# Altium project HÜMA_USV.PrjPcb
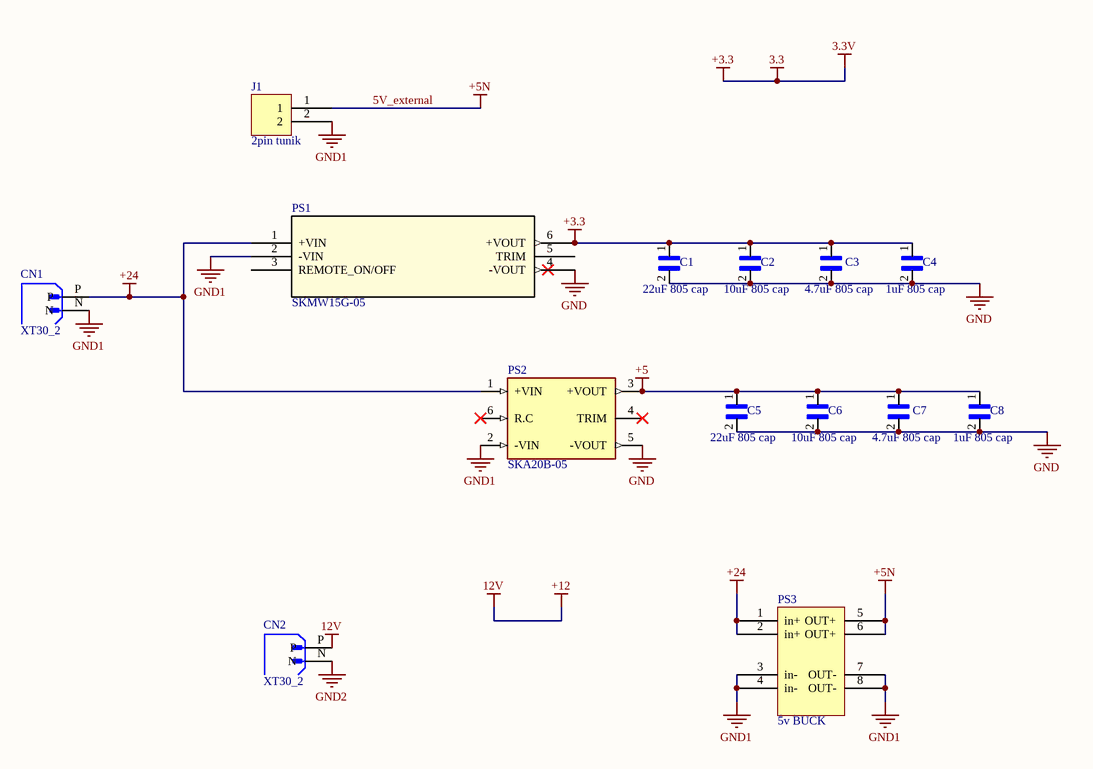
[diagram p0: Power.SchDoc]
10 sheets, 153 parts. Net scope: global (net labels, ports and power ports of the same name join across sheets).
Board file: HÜMA_USV.PcbDoc
Sheets:
  Hüma_USV_Main.SchDoc
  Power.SchDoc
  Battey_Voltage.SchDoc
  Flash_Driver.SchDoc
  BNO055.SchDoc
  NEO-M9N.SchDoc
  ekstralar.SchDoc
  Teensy4.1.SchDoc
  Emergancy.SchDoc
  Motor_ESC.SchDoc

## Sheet Hüma_USV_Main.SchDoc
size A4; SheetNumber: 1; SheetTotal: 1

## Sheet Power.SchDoc
size A4; SheetNumber: 2; SheetTotal: 10

### Parts
C1  22uF 805 cap  [1uF 805 Cap]
C2  10uF 805 cap  [1uF 805 Cap]
C3  4.7uF 805 cap  [1uF 805 Cap]
C4  1uF 805 cap  [1uF 805 Cap]
C5  22uF 805 cap  [1uF 805 Cap]
C6  10uF 805 cap  [1uF 805 Cap]
C7  4.7uF 805 cap  [1uF 805 Cap]
C8  1uF 805 cap  [1uF 805 Cap]
CN1  XT30_2  [XT30_2]
CN2  XT30_2  [XT30_2]
J1  2pin tunik  [2pin tunşk]
PS1  SKMW15G-05  [SKMW15DKMW15_MWU]
PS2  SKA20B-05  [CONV_SKA20B-05]
PS3  5v BUCK  [5V Buck Conv]

### Nets
5V_external: J1.1 PS3.5(OUT+) PS3.6(OUT+)  [also labelled +5N]
+3.3: C1.1 C2.1 C3.1 C4.1 PS1.6(+VOUT)  [also labelled 3.3, 3.3V]  [project net XTAL_IN]
+5: C5.1 C6.1 C7.1 C8.1 PS2.3(+VOUT)
+12: CN2.P  [also labelled 12V]
+24: CN1.P PS1.1(+VIN) PS2.1(+VIN) PS3.1(in+) PS3.2(in+)
GND: C1.2 C2.2 C3.2 C4.2 C5.2 C6.2 C7.2 C8.2 PS1.4(-VOUT) PS2.5(-VOUT)
GND1: CN1.N J1.2 PS1.2(-VIN) PS2.2(-VIN) PS3.3(in-) PS3.4(in-) PS3.7(OUT-) PS3.8(OUT-)
GND2: CN2.N

Not connected (* = marked no-connect by the designer): PS1 3(REMOTE_ON/OFF) 5(TRIM); PS2 4(TRIM)* 6(R.C)*

### Library data of the parts
C1-C3 C5-C7 = 1uF 805 cap
PS1 = SKMW15G-03_1: No Description Available; Manufacturer_Name: Mean Well; Copyright: Copyright (C) 2025 Ultra Librarian. All rights reserved.; Manufacturer_Part_Number: SKMW15G-05; RefDes: RefDes; Type: Type
PS2 = SKA20B-05: Isolated Module DC DC Converter 1 Output 5V 4A 18V - 36V Input; Package: None; Price: None; Value: *; MP: SKA20B-05; Availability: Unavailable

## Sheet Battey_Voltage.SchDoc
size A4; SheetNumber: 3; SheetTotal: 9
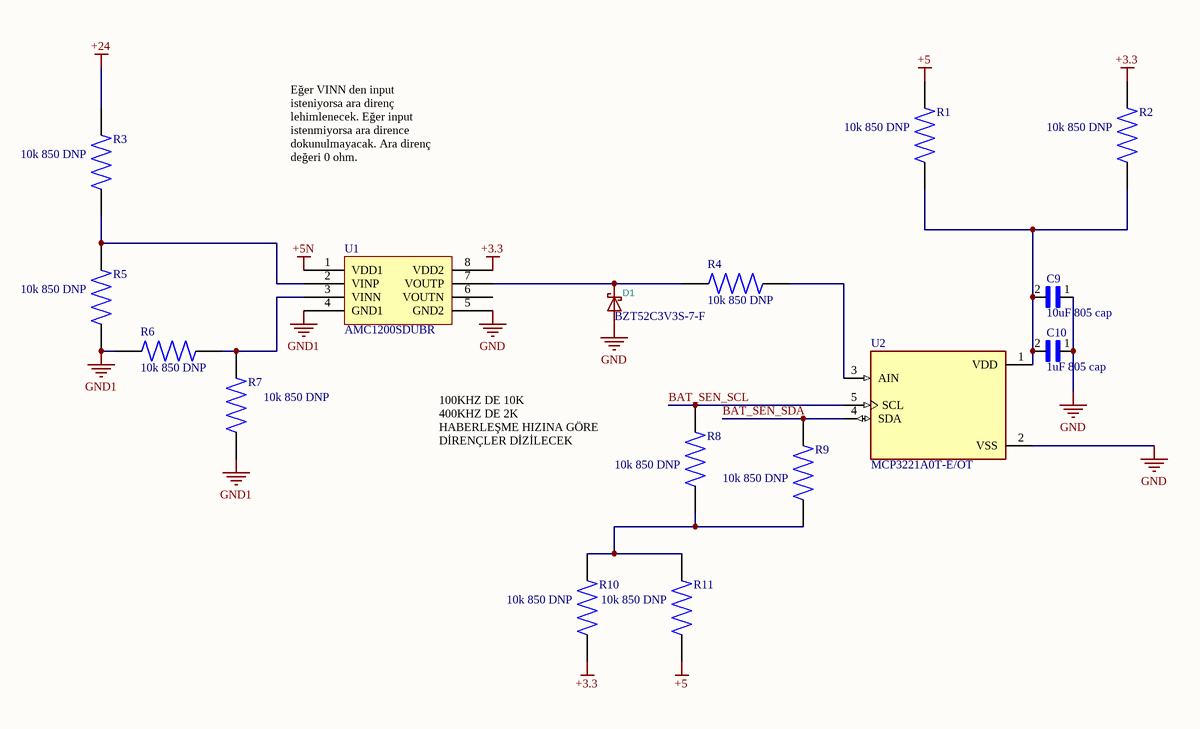
[diagram p1: Battey_Voltage.SchDoc]

### Parts
C9  10uF 805 cap  [1uF 805 Cap]
C10  1uF 805 cap  [1uF 805 Cap]
D1  BZT52C3V3S-7-F  [SOD2513X120N]
R1  10k 850 DNP  [10k 850]
R2  10k 850 DNP  [10k 850]
R3  10k 850 DNP  [10k 850]
R4  10k 850 DNP  [10k 850]
R5  10k 850 DNP  [10k 850]
R6  10k 850 DNP  [10k 850]
R7  10k 850 DNP  [10k 850]
R8  10k 850 DNP  [10k 850]
R9  10k 850 DNP  [10k 850]
R10  10k 850 DNP  [10k 850]
R11  10k 850 DNP  [10k 850]
U1  AMC1200SDUBR  [SOP254P1040X485-8N]
U2  MCP3221A0T-E/OT  [SOT95P280X145-5N]

### Nets
+3.3: R2.1 R10.2 U1.8(VDD2)  [project net XTAL_IN]
+5: R1.1 R11.2
+5N: U1.1(VDD1)  [project net 5V_external]
+24: R3.1
GND: C9.1 C10.1 D1.A U1.5(GND2) U2.2(VSS)
GND1: R5.2 R6.2 R7.1 U1.4(GND1)
BAT_SEN_SCL: R8.2 U2.5(SCL)
BAT_SEN_SDA: R9.2 U2.4(SDA)
NetC9_2: C9.2 C10.2 R1.2 R2.2 U2.1(VDD)
NetD1_K: D1.K R4.1 U1.7(VOUTP)
NetR3_2: R3.2 R5.1 U1.2(VINP)
NetR4_2: R4.2 U2.3(AIN)
NetR6_1: R6.1 R7.2 U1.3(VINN)
NetR8_1: R8.1 R9.1 R10.1 R11.1

Not connected (* = marked no-connect by the designer): U1 6(VOUTN)

### Notes on the sheet
- Eğer VINN den input isteniyorsa ara direnç lehimlenecek. Eğer input istenmiyorsa ara dirence dokunulmayacak. Ara direnç değeri 0 ohm.
- 100KHZ DE 10K
  400KHZ DE 2K
  HABERLEŞME HIZINA GÖRE DİRENÇLER DİZİLECEK

### Library data of the parts
C9 = 1uF 805 cap
D1 = BZT52C3V3S-7-F: ki_keywords: Schottky; ki_description: Schottky Diode; Datasheet: https://diotec.com/de/produktliste/SBD.html
R1-R11 = 10k 850
U2 = MCP3221A0T-E/OT: 12-bit ADC, I2C, single channel5 SOT-23 T/R | Microchip Technology Inc. MCP3221A0T-E/OT; SnapEDA_Link: https://www.snapeda.com/parts/MCP3221A0T-E/OT/Microchip/view-part/?ref=snap; Package: SOT-23 Microchip; Value: *; MF: Microchip Technology; MP: MCP3221A0T-E/OT; Check_prices: https://www.snapeda.com/parts/MCP3221A0T-E/OT/Microchip/view-part/?ref=eda

## Sheet Flash_Driver.SchDoc
size A4; SheetNumber: 4; SheetTotal: 9
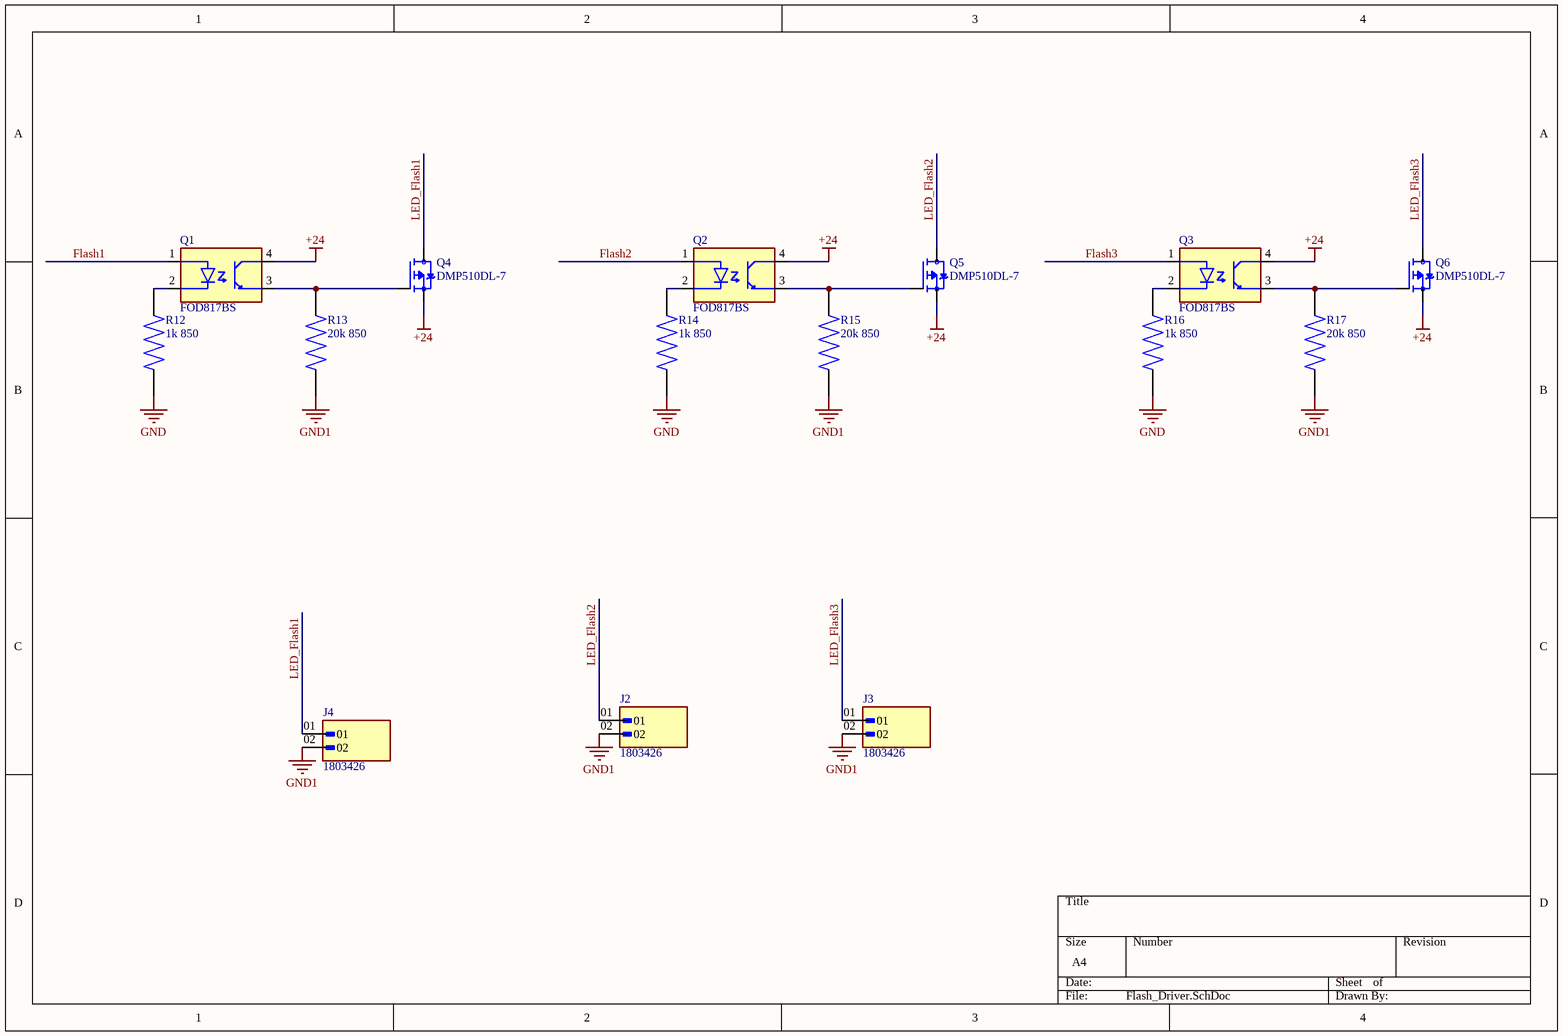
[diagram p2: Flash_Driver.SchDoc]

### Parts
J2  1803426  [PHOENIX_1803426]
J3  1803426  [PHOENIX_1803426]
J4  1803426  [PHOENIX_1803426]
Q1  FOD817BS  [SOIC254P1016X385-4N]
Q2  FOD817BS  [SOIC254P1016X385-4N]
Q3  FOD817BS  [SOIC254P1016X385-4N]
Q4  DMP510DL-7  [SOT91P240X110-3N - duplicate]
Q5  DMP510DL-7  [SOT91P240X110-3N - duplicate]
Q6  DMP510DL-7  [SOT91P240X110-3N - duplicate]
R12  1k 850  [10k 850]
R13  20k 850  [10k 850]
R14  1k 850  [10k 850]
R15  20k 850  [10k 850]
R16  1k 850  [10k 850]
R17  20k 850  [10k 850]

### Nets
+24: Q1.4(COLLECTOR) Q2.4(COLLECTOR) Q3.4(COLLECTOR) Q4.2(S) Q5.2(S) Q6.2(S)
GND: R12.2 R14.2 R16.2
GND1: J2.02 J3.02 J4.02 R13.2 R15.2 R17.2
Flash1: Q1.1(ANODE)
Flash2: Q2.1(ANODE)
Flash3: Q3.1(ANODE)
LED_Flash1: J4.01 Q4.3(D)
LED_Flash2: J2.01 Q5.3(D)
LED_Flash3: J3.01 Q6.3(D)
NetQ1_2: Q1.2(CATHODE) R12.1
NetQ1_3: Q1.3(EMITTER) Q4.1(G) R13.1
NetQ2_2: Q2.2(CATHODE) R14.1
NetQ2_3: Q2.3(EMITTER) Q5.1(G) R15.1
NetQ3_2: Q3.2(CATHODE) R16.1
NetQ3_3: Q3.3(EMITTER) Q6.1(G) R17.1

### Library data of the parts
J2-J4 = 1803426: Pluggable Header 3.81mm 16AWG 160V 8A 2 Position COMBICON MCV Series | Phoenix Contact 1803426; SnapEDA_Link: https://www.snapeda.com/parts/1803426/Phoenix+Contact/view-part/?ref=snap; Package: None; Value: *; MF: Phoenix Contact; MP: 1803426; Check_prices: https://www.snapeda.com/parts/1803426/Phoenix+Contact/view-part/?ref=eda
Q1-Q3 = FOD817BS: Transistor Output Optocouplers Opto Phototransistor Output SM-DIP4; MF: ON Semiconductor; SnapEDA_Link: https://www.snapeda.com/parts/FOD817BS/Onsemi/view-part/?ref=snap; Package: SMD-4 ON Semiconductor; Value: *; MP: FOD817BS; Check_prices: https://www.snapeda.com/parts/FOD817BS/Onsemi/view-part/?ref=eda
R12-R17 = 10k 850

## Sheet BNO055.SchDoc
size A4; SheetNumber: 5; SheetTotal: 10
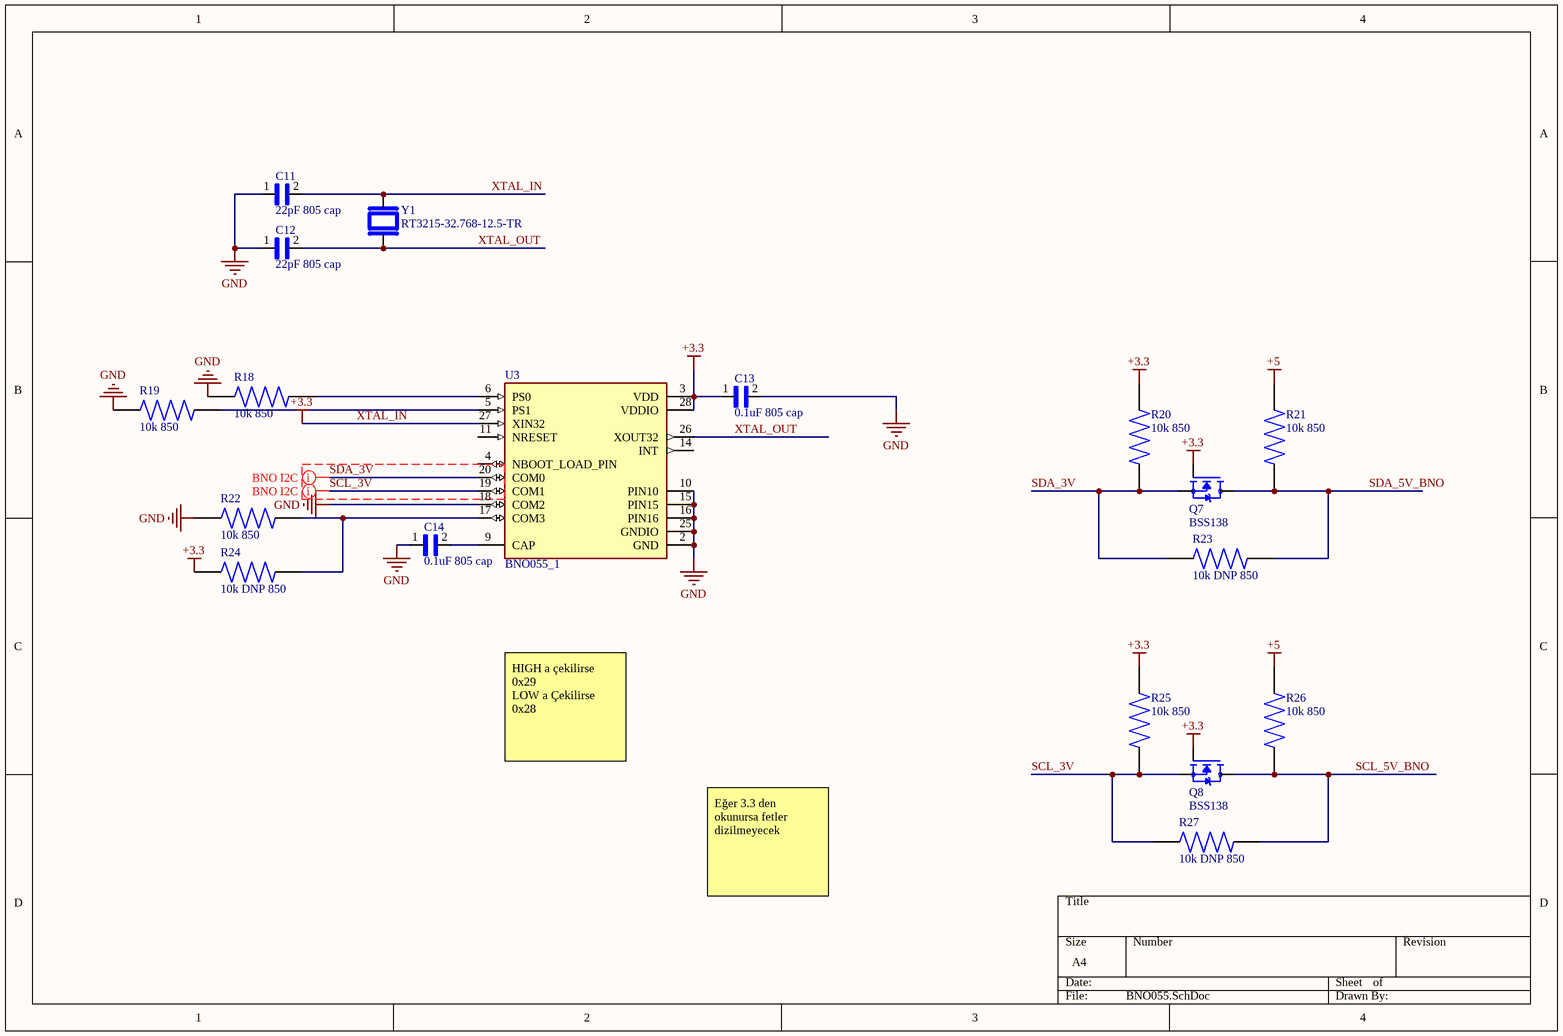
[diagram p3: BNO055.SchDoc]

### Parts
C11  22pF 805 cap  [1uF 805 Cap]
C12  22pF 805 cap  [1uF 805 Cap]
C13  0.1uF 805 cap  [1uF 805 Cap]
C14  0.1uF 805 cap  [1uF 805 Cap]
Q7  BSS138  [SOT91P240X110-3N - duplicate]
Q8  BSS138  [SOT91P240X110-3N - duplicate]
R18  10k 850  [10k 850]
R19  10k 850  [10k 850]
R20  10k 850  [10k 850]
R21  10k 850  [10k 850]
R22  10k 850  [10k 850]
R23  10k DNP 850  [10k 850]
R24  10k DNP 850  [10k 850]
R25  10k 850  [10k 850]
R26  10k 850  [10k 850]
R27  10k DNP 850  [10k 850]
U3  BNO055_1  [LGA28R50P4X10_380X520X100]
Y1  RT3215-32.768-12.5-TR  [XTAL_RT3215-32.768-12.5-TR]

### Nets
+5: R21.1 R26.1
GND: C11.1 C12.1 C13.2 C14.1 R18.1 R19.1 R22.1 U3.2(GND) U3.10(PIN10) U3.15(PIN15) U3.16(PIN16) U3.18(COM2) U3.25(GNDIO)
XTAL_IN: C11.2 C13.1 Q7.1(G) Q8.1(G) R20.1 R24.1 R25.1 U3.3(VDD) U3.27(XIN32) U3.28(VDDIO) Y1.1  [also labelled +3.3]
SCL_3V: Q8.2(S) R25.2 R27.1 U3.19(COM1)
SCL_5V_BNO: Q8.3(D) R26.2 R27.2  [project net BNO055SDA]
SDA_3V: Q7.2(S) R20.2 R23.1 U3.20(COM0)
SDA_5V_BNO: Q7.3(D) R21.2 R23.2  [project net BNO055SCL]
XTAL_OUT: C12.2 U3.26(XOUT32) Y1.2
NetC14_2: C14.2 U3.9(CAP)
NetR18_2: R18.2 U3.6(PS0)
NetR19_2: R19.2 U3.5(PS1)
NetR22_2: R22.2 R24.2 U3.17(COM3)

Not connected (* = marked no-connect by the designer): U3 4(NBOOT_LOAD_PIN) 11(NRESET) 14(INT)

### Layout directives
mark named BNO I2C: SCL_3V, SDA_3V

### Notes on the sheet
- HIGH a çekilirse 0x29
  LOW a Çekilirse 0x28
- Eğer 3.3 den okunursa fetler dizilmeyecek

### Library data of the parts
C11-C14 = 1uF 805 cap
Q7 Q8 = BSS138: N-Channel 50 V 220mA (Ta) 350mW (Ta) Surface Mount SOT-23-3; MF: onsemi; SnapEDA_Link: https://www.snapeda.com/parts/BSS138/Onsemi/view-part/?ref=snap; Package: SOT-23-3 ON Semiconductor; Value: *; MP: BSS138; Check_prices: https://www.snapeda.com/parts/BSS138/Onsemi/view-part/?ref=eda
R23 R24 R27 = 10k 850
U3 = BNO055_1: BNO055 9-axis Absolute Orientation Sensor ( SiP ) w/Sensors and Sensor Fusion; Package: None; Price: None; Value: *; MP: BNO055; Availability: Unavailable
Y1 = RT3215-32.768-12.5-TR: 32.768 kHz Â±20ppm Crystal 12.5pF 70 kOhms 2-SMD, No Lead; MF: Raltron Electronics; Package: SMD-2 Raltron Electronics; Price: None; Check_prices: https://www.snapeda.com/parts/RT3215-32.768-12.5-TR/Raltron+Electronics/view-part/?ref=eda; Value: *; SnapEDA_Link: https://www.snapeda.com/parts/RT3215-32.768-12.5-TR/Raltron+Electronics/view-part/?ref=snap; MP: RT3215-32.768-12.5-TR; Availability: In Stock; Purchase-URL: https://pricing.snapeda.com/search?q=RT3215-32.768-12.5-TR&ref=eda

## Sheet NEO-M9N.SchDoc
size A4; SheetNumber: 6; SheetTotal: 10
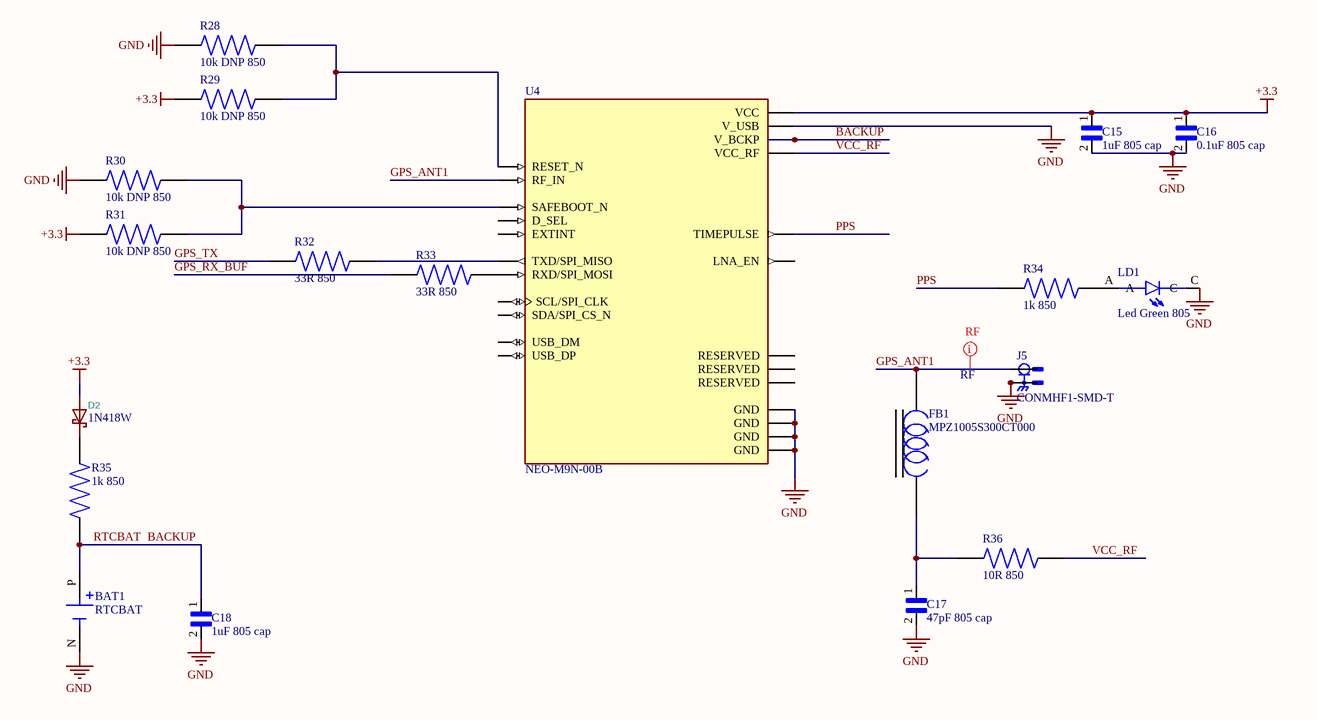
[diagram p4: NEO-M9N.SchDoc]

### Parts
BAT1  RTCBAT  [RTCBATTERY]
C15  1uF 805 cap  [1uF 805 Cap]
C16  0.1uF 805 cap  [1uF 805 Cap]
C17  47pF 805 cap  [1uF 805 Cap]
C18  1uF 805 cap  [1uF 805 Cap]
D2  1N418W  [SOD-523]
FB1  MPZ1005S300CT000  [BEADC1005X50N]
J5  CONMHF1-SMD-T  [TE_CONMHF1-SMD-T]
LD1  Led Green 805  [Led Green 805]
R28  10k DNP 850  [10k 850]
R29  10k DNP 850  [10k 850]
R30  10k DNP 850  [10k 850]
R31  10k DNP 850  [10k 850]
R32  33R 850  [10k 850]
R33  33R 850  [10k 850]
R34  1k 850  [10k 850]
R35  1k 850  [10k 850]
R36  10R 850  [10k 850]
U4  NEO-M9N-00B  [XCVR_NEO-M9N-00B]

### Nets
+3.3: C15.1 C16.1 D2.A R29.1 R31.1 U4.23(VCC)  [project net XTAL_IN]
GND: BAT1.N(NEG) C15.2 C16.2 C17.2 C18.2 J5.2(GND) J5.3(GND) J5.4(GND) LD1.C R28.1 R30.1 U4.7(V_USB) U4.10(GND) U4.12(GND) U4.13(GND) U4.24(GND)
BACKUP: BAT1.P(POS) C18.1 R35.2 U4.22(V_BCKP)  [also labelled RTCBAT]
GPS_ANT1: FB1.1 J5.1(SIG) U4.11(RF_IN)
GPS_RX_BUF: R33.1
GPS_TX: R32.1
PPS: R34.1 U4.3(TIMEPULSE)
VCC_RF: R36.2 U4.9(VCC_RF)
NetC17_1: C17.1 FB1.2 R36.1
NetD2_K: D2.K R35.1
NetLD1_A: LD1.A R34.2
NetR28_2: R28.2 R29.2 U4.8(RESET_N)
NetR30_2: R30.2 R31.2 U4.1(SAFEBOOT_N)
NetR32_2: R32.2 U4.20(TXD/SPI_MISO)
NetR33_2: R33.2 U4.21(RXD/SPI_MOSI)

Not connected (* = marked no-connect by the designer): U4 2(D_SEL) 4(EXTINT) 5(USB_DM) 6(USB_DP) 14(LNA_EN) 15(RESERVED) 16(RESERVED) 17(RESERVED) 18(SDA/SPI_CS_N) 19(SCL/SPI_CLK)

### Layout directives
net class RF: GPS_ANT1

### Library data of the parts
C16 C17 = 1uF 805 cap
D2 = 1N418W: ki_keywords: Schottky; ki_description: Schottky Diode; Datasheet: https://diotec.com/de/produktliste/SBD.html
R28-R36 = 10k 850
U4 = NEO-M9N-00B: series RF Receiver BeiDou, Galileo, GLONASS, GNSS, GPS - -167dBm - - Module; MF: u-blox; SnapEDA_Link: https://www.snapeda.com/parts/NEO-M9N-00B/u-blox/view-part/?ref=snap; Package: SMD-24 u-blox; Value: *; MP: NEO-M9N-00B; Check_prices: https://www.snapeda.com/parts/NEO-M9N-00B/u-blox/view-part/?ref=eda
J5 = CONMHF1-SMD-T: Package: None; Price: None; Value: *; MP: CONMHF1-SMD-T; Availability: Unavailable

## Sheet ekstralar.SchDoc
size A4; SheetNumber: 7; SheetTotal: 10
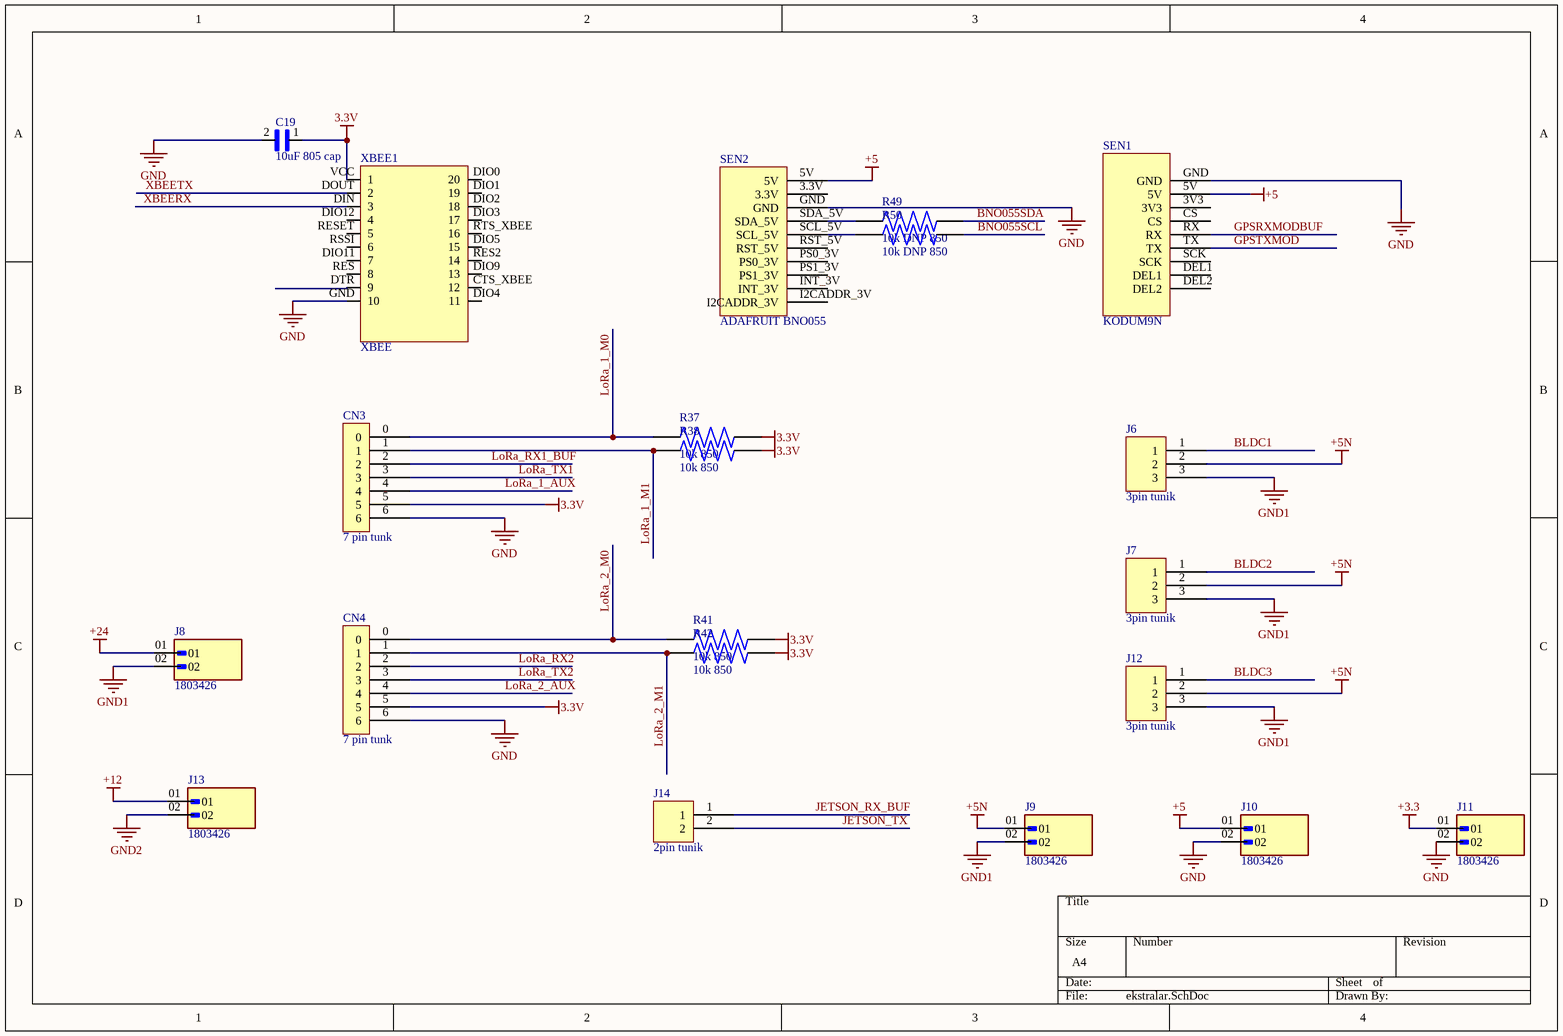
[diagram p5: ekstralar.SchDoc]

### Parts
C19  10uF 805 cap  [1uF 805 Cap]
CN3  7 pin tunk  [7 pin tunik]
CN4  7 pin tunk  [7 pin tunik]
J6  3pin tunik  [3pin tunik]
J7  3pin tunik  [3pin tunik]
J8  1803426  [PHOENIX_1803426]
J9  1803426  [PHOENIX_1803426]
J10  1803426  [PHOENIX_1803426]
J11  1803426  [PHOENIX_1803426]
J12  3pin tunik  [3pin tunik]
J13  1803426  [PHOENIX_1803426]
J14  2pin tunik  [2pin tunşk]
R37  10k 850  [10k 850]
R38  10k 850  [10k 850]
R41  10k 850  [10k 850]
R42  10k 850  [10k 850]
R49  10k DNP 850  [10k 850]
R50  10k DNP 850  [10k 850]
SEN1  KODUM9N  [KODUM9N]
SEN2  ADAFRUIT BNO055  [ADAFRUIT BNO055]
XBEE1  XBEE  [xbee_1]

### Nets
+3.3: C19.1 CN3.5 CN4.5 J11.01 R37.1 R38.1 R41.1 R42.1 XBEE1.VCC(1)  [also labelled 3.3V]  [project net XTAL_IN]
+5: J10.01 SEN1.5V SEN2.5V
+5N: J6.2 J7.2 J9.01 J12.2  [project net 5V_external]
+12: J13.01
+24: J8.01
GND: C19.2 CN3.6 CN4.6 J10.02 J11.02 SEN1.GND SEN2.GND XBEE1.GND(10)
GND1: J6.3 J7.3 J8.02 J9.02 J12.3
GND2: J13.02
BLDC1: J6.1
BLDC2: J7.1
BLDC3: J12.1
BNO055SCL: R50.2
BNO055SDA: R49.2
GPSRXMODBUF: SEN1.RX
GPSTXMOD: SEN1.TX
JETSON_RX_BUF: J14.1
JETSON_TX: J14.2
LoRa_1_AUX: CN3.4
LoRa_1_M0: CN3.0 R37.2
LoRa_1_M1: CN3.1 R38.2
LoRa_2_AUX: CN4.4
LoRa_2_M0: CN4.0 R41.2
LoRa_2_M1: CN4.1 R42.2
LoRa_RX1_BUF: CN3.2
LoRa_RX2: CN4.2
LoRa_TX1: CN3.3
LoRa_TX2: CN4.3
XBEERX: XBEE1.DIN(3)
XBEETX: XBEE1.DOUT(2)
NetR49_1: R49.1 SEN2.SDA_5V
NetR50_1: R50.1 SEN2.SCL_5V

Not connected (* = marked no-connect by the designer): SEN1 3V3 CS DEL1 DEL2 SCK; SEN2 3.3V I2CADDR_3V INT_3V PS0_3V PS1_3V RST_5V; XBEE1 CTS_XBEE(12) DIO0(20) DIO1(19) DIO2(18) DIO3(17) DIO4(11) DIO5(15) DIO9(13) DIO11(7) DIO12(4) DTR(9) RES(8) RES2(14) RESET(5) RSSI(6) RTS_XBEE(16)

### Library data of the parts
C19 = 1uF 805 cap
J8-J11 J13 = 1803426: as J2 on sheet Flash_Driver; SnapEDA_Link: https://www.snapeda.com/parts/1803426/Phoenix+Contact/view-part/?ref=snap; Package: None; Value: *; MF: Phoenix Contact; MP: 1803426; Check_prices: https://www.snapeda.com/parts/1803426/Phoenix+Contact/view-part/?ref=eda
R49 R50 = 10k 850

## Sheet Teensy4.1.SchDoc
size A4; SheetNumber: 8; SheetTotal: 10
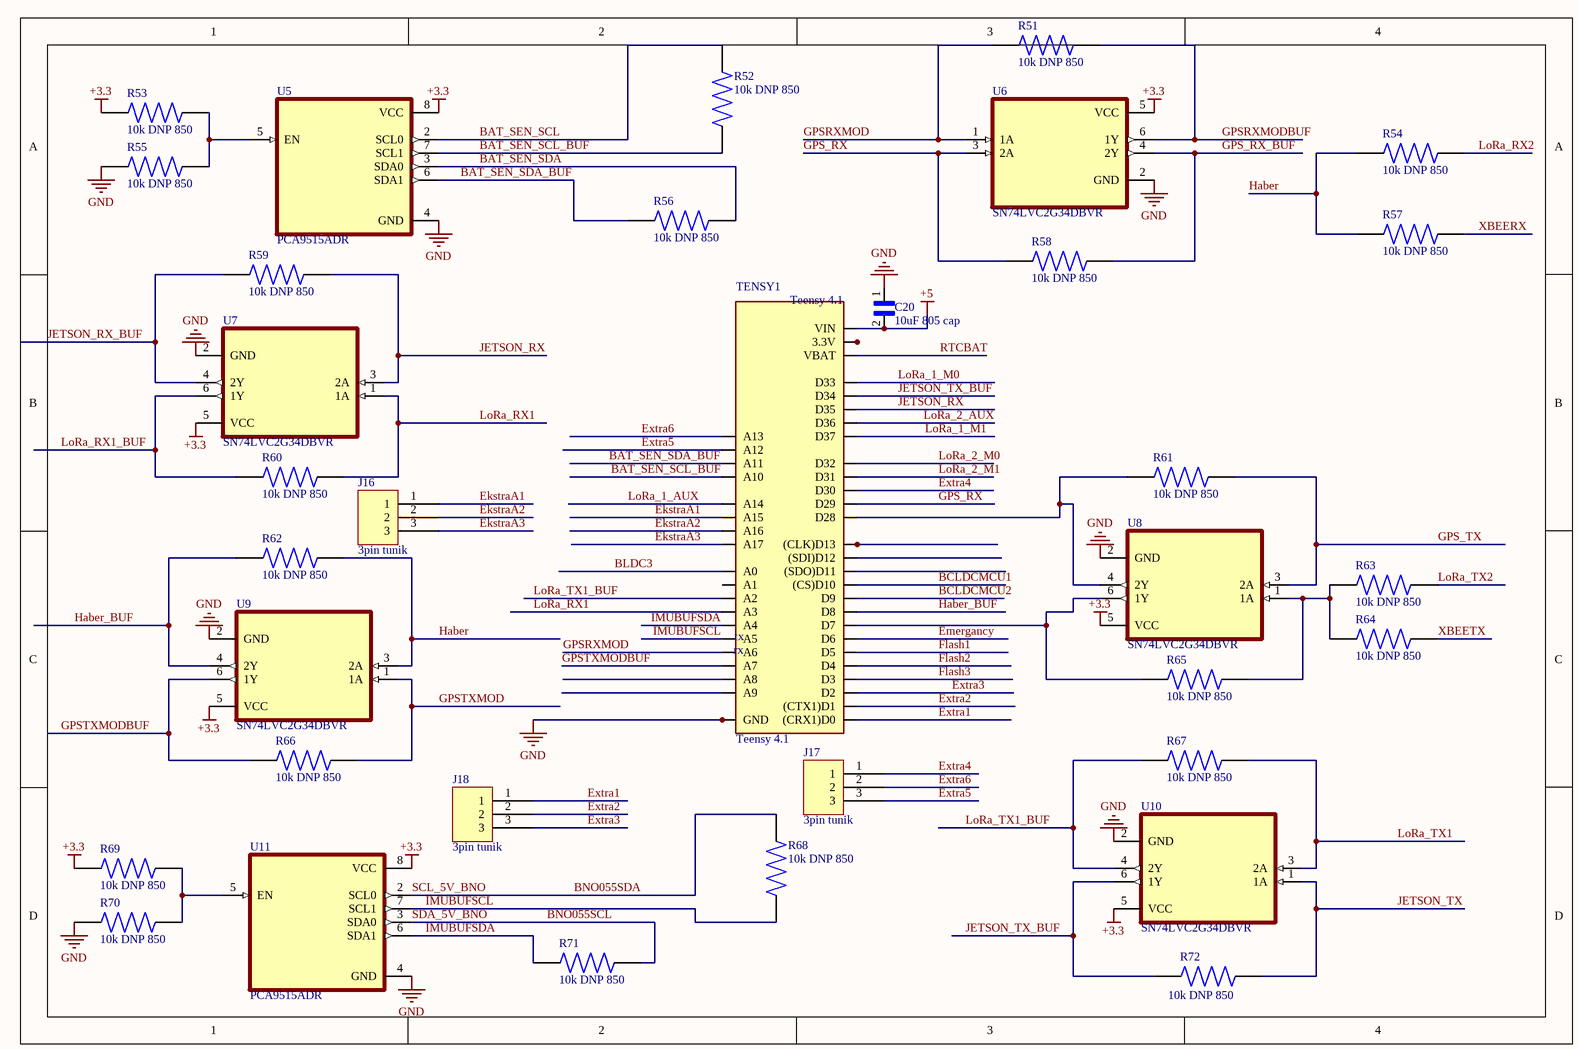
[diagram p6: Teensy4.1.SchDoc]

### Parts
C20  10uF 805 cap  [1uF 805 Cap]
J16  3pin tunik  [3pin tunik]
J17  3pin tunik  [3pin tunik]
J18  3pin tunik  [3pin tunik]
R51  10k DNP 850  [10k 850]
R52  10k DNP 850  [10k 850]
R53  10k DNP 850  [10k 850]
R54  10k DNP 850  [10k 850]
R55  10k DNP 850  [10k 850]
R56  10k DNP 850  [10k 850]
R57  10k DNP 850  [10k 850]
R58  10k DNP 850  [10k 850]
R59  10k DNP 850  [10k 850]
R60  10k DNP 850  [10k 850]
R61  10k DNP 850  [10k 850]
R62  10k DNP 850  [10k 850]
R63  10k DNP 850  [10k 850]
R64  10k DNP 850  [10k 850]
R65  10k DNP 850  [10k 850]
R66  10k DNP 850  [10k 850]
R67  10k DNP 850  [10k 850]
R68  10k DNP 850  [10k 850]
R69  10k DNP 850  [10k 850]
R70  10k DNP 850  [10k 850]
R71  10k DNP 850  [10k 850]
R72  10k DNP 850  [10k 850]
TENSY1  Teensy 4.1  [Teensy 4.1]
U5  PCA9515ADR  [SOIC127P599X175-8N]
U6  SN74LVC2G34DBVR  [SOT95P280X145-6N]
U7  SN74LVC2G34DBVR  [SOT95P280X145-6N]
U8  SN74LVC2G34DBVR  [SOT95P280X145-6N]
U9  SN74LVC2G34DBVR  [SOT95P280X145-6N]
U10  SN74LVC2G34DBVR  [SOT95P280X145-6N]
U11  PCA9515ADR  [SOIC127P599X175-8N]

### Nets
+3.3: R53.1 R69.1 U5.8(VCC) U6.5(VCC) U7.5(VCC) U8.5(VCC) U9.5(VCC) U10.5(VCC) U11.8(VCC)  [project net XTAL_IN]
+5: C20.2 TENSY1.VIN
GND: C20.1 R55.1 R70.1 TENSY1.AGND/GND(GND) TENSY1.GND TENSY1.GND@2(GND) U5.4(GND) U6.2(GND) U7.2(GND) U8.2(GND) U9.2(GND) U10.2(GND) U11.4(GND)
BAT_SEN_SCL: R52.1 U5.2(SCL0)
BAT_SEN_SCL_BUF: R52.2 TENSY1.D24(A10) U5.7(SCL1)
BAT_SEN_SDA: R56.2 U5.3(SDA0)
BAT_SEN_SDA_BUF: R56.1 TENSY1.D25(A11) U5.6(SDA1)
BCLDCMCU1: TENSY1.D10((CS)D10)
BCLDCMCU2: TENSY1.D9
BLDC3: TENSY1.D14(A0)
BNO055SCL: R71.2 U11.3(SDA0)  [also labelled SDA_5V_BNO]
BNO055SDA: R68.1 U11.2(SCL0)  [also labelled SCL_5V_BNO]
EkstraA1: J16.1 TENSY1.D39(A15)
EkstraA2: J16.2 TENSY1.D40(A16)
EkstraA3: J16.3 TENSY1.D41(A17)
Emergancy: TENSY1.D6
Extra1: J18.1 TENSY1.D0((CRX1)D0)
Extra2: J18.2 TENSY1.D1((CTX1)D1)
Extra3: J18.3 TENSY1.D2
Extra4: J17.1 TENSY1.D30
Extra5: J17.3 TENSY1.D26(A12)
Extra6: J17.2 TENSY1.D27(A13)
Flash1: TENSY1.D5
Flash2: TENSY1.D4
Flash3: TENSY1.D3
GPS_RX: R58.1 TENSY1.D29 U6.3(2A)
GPS_RX_BUF: R58.2 U6.4(2Y)
GPS_TX: R61.2 U8.3(2A)
GPSRXMOD: R51.1 TENSY1.D20(A6) U6.1(1A)
GPSRXMODBUF: R51.2 U6.6(1Y)
GPSTXMOD: R66.2 U9.1(1A)
GPSTXMODBUF: R66.1 TENSY1.D21(A7) U9.6(1Y)
Haber: R54.1 R57.1 R62.2 U9.3(2A)
Haber_BUF: R62.1 TENSY1.D8 U9.4(2Y)
IMUBUFSCL: R68.2 TENSY1.D19(A5) U11.7(SCL1)
IMUBUFSDA: R71.1 TENSY1.D18(A4) U11.6(SDA1)
JETSON_RX: R59.2 TENSY1.D35 U7.3(2A)
JETSON_RX_BUF: R59.1 U7.4(2Y)
JETSON_TX: R72.2 U10.1(1A)
JETSON_TX_BUF: R72.1 TENSY1.D34 U10.6(1Y)
LoRa_1_AUX: TENSY1.D38(A14)
LoRa_1_M0: TENSY1.D33
LoRa_1_M1: TENSY1.D37
LoRa_2_AUX: TENSY1.D36
LoRa_2_M0: TENSY1.D32
LoRa_2_M1: TENSY1.D31
LoRa_RX1: R60.2 TENSY1.D17(A3) U7.1(1A)
LoRa_RX1_BUF: R60.1 U7.6(1Y)
LoRa_RX2: R54.2
LoRa_TX1: R67.2 U10.3(2A)
LoRa_TX1_BUF: R67.1 TENSY1.D16(A2) U10.4(2Y)
LoRa_TX2: R63.2
RTCBAT: TENSY1.VBAT  [project net BACKUP]
XBEERX: R57.2
XBEETX: R64.2
NetR53_2: R53.2 R55.2 U5.5(EN)
NetR61_1: R61.1 TENSY1.D28 U8.4(2Y)
NetR63_1: R63.1 R64.1 R65.2 U8.1(1A)
NetR65_1: R65.1 TENSY1.D7 U8.6(1Y)
NetR69_2: R69.2 R70.2 U11.5(EN)
NetTENSY1_3V3: TENSY1.3V3(3.3V) TENSY1.3V3@2(3.3V) TENSY1.3V3@3(3.3V)

Not connected (* = marked no-connect by the designer): TENSY1 D11((SDO)D11) D12((SDI)D12) D13((CLK)D13) D15(A1) D22(A8) D23(A9)

### Notes on the sheet
- (near TENSY1) rx
- (near TENSY1) tx

### Library data of the parts
C20 = 1uF 805 cap
R51-R72 = 10k 850
U5 U11 = PCA9515ADR: Dual Bidirectional I2C Bus and SMBus Repeater 8-SOIC -40 to 85; MF: Texas Instruments; SnapEDA_Link: https://www.snapeda.com/parts/PCA9515ADR/Texas+Instruments/view-part/?ref=snap; Package: SOIC-8 Texas Instruments; Value: *; MP: PCA9515ADR; Check_prices: https://www.snapeda.com/parts/PCA9515ADR/Texas+Instruments/view-part/?ref=eda
U6-U10 = SN74LVC2G34DBVR: 2-ch, 1.65-V to 5.5-V buffers; MF: Texas Instruments; SnapEDA_Link: https://www.snapeda.com/parts/SN74LVC2G34DBVR/Texas+Instruments/view-part/?ref=snap; Package: SOT-23-6 Texas Instruments; Value: *; MP: SN74LVC2G34DBVR; Check_prices: https://www.snapeda.com/parts/SN74LVC2G34DBVR/Texas+Instruments/view-part/?ref=eda

## Sheet Emergancy.SchDoc
size A4; SheetNumber: 9; SheetTotal: 10
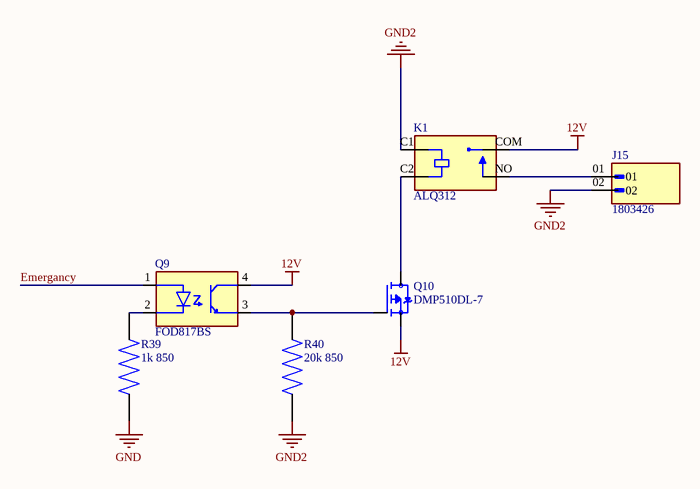
[diagram p7: Emergancy.SchDoc]

### Parts
J15  1803426  [PHOENIX_1803426]
K1  ALQ312  [RELAY_ALQ312]
Q9  FOD817BS  [SOIC254P1016X385-4N]
Q10  DMP510DL-7  [SOT91P240X110-3N - duplicate]
R39  1k 850  [10k 850]
R40  20k 850  [10k 850]

### Nets
12V: K1.COM Q9.4(COLLECTOR) Q10.2(S)  [project net +12]
GND: R39.2
GND2: J15.02 K1.C1(COIL1) R40.2
Emergancy: Q9.1(ANODE)
NetJ15_01: J15.01 K1.NO
NetK1_C2: K1.C2(COIL2) Q10.3(D)
NetQ9_2: Q9.2(CATHODE) R39.1
NetQ9_3: Q9.3(EMITTER) Q10.1(G) R40.1

### Library data of the parts
J15 = 1803426: as J2 on sheet Flash_Driver; SnapEDA_Link: https://www.snapeda.com/parts/1803426/Phoenix+Contact/view-part/?ref=snap; Package: None; Value: *; MF: Phoenix Contact; MP: 1803426; Check_prices: https://www.snapeda.com/parts/1803426/Phoenix+Contact/view-part/?ref=eda
K1 = ALQ312: General Purpose Relay SPST-NO (1 Form A) 12VDC Coil Through Hole; MF: Panasonic Electric; Package: DIP-4; Price: None; Value: *; SnapEDA_Link: https://www.snapeda.com/parts/ALQ312/Panasonic+Electric+Works/view-part/?ref=snap; MP: ALQ312; Availability: Unavailable; Check_prices: https://www.snapeda.com/parts/ALQ312/Panasonic+Electric+Works/view-part/?ref=eda
Q9 = FOD817BS: as Q1 on sheet Flash_Driver; SnapEDA_Link: https://www.snapeda.com/parts/FOD817BS/Onsemi/view-part/?ref=snap; Package: SMD-4 ON Semiconductor; Value: *; MP: FOD817BS; Check_prices: https://www.snapeda.com/parts/FOD817BS/Onsemi/view-part/?ref=eda
R39 R40 = 10k 850

## Sheet Motor_ESC.SchDoc
size A4; SheetNumber: 10; SheetTotal: 10
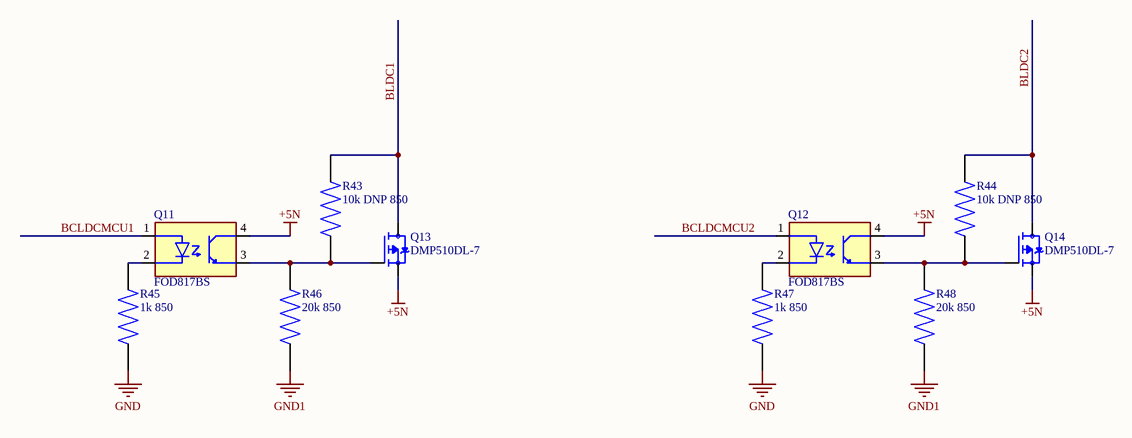
[diagram p8: Motor_ESC.SchDoc]

### Parts
Q11  FOD817BS  [SOIC254P1016X385-4N]
Q12  FOD817BS  [SOIC254P1016X385-4N]
Q13  DMP510DL-7  [SOT91P240X110-3N - duplicate]
Q14  DMP510DL-7  [SOT91P240X110-3N - duplicate]
R43  10k DNP 850  [10k 850]
R44  10k DNP 850  [10k 850]
R45  1k 850  [10k 850]
R46  20k 850  [10k 850]
R47  1k 850  [10k 850]
R48  20k 850  [10k 850]

### Nets
+5N: Q11.4(COLLECTOR) Q12.4(COLLECTOR) Q13.2(S) Q14.2(S)  [project net 5V_external]
GND: R45.2 R47.2
GND1: R46.2 R48.2
BCLDCMCU1: Q11.1(ANODE)
BCLDCMCU2: Q12.1(ANODE)
BLDC1: Q13.3(D) R43.1
BLDC2: Q14.3(D) R44.1
NetQ11_2: Q11.2(CATHODE) R45.1
NetQ11_3: Q11.3(EMITTER) Q13.1(G) R43.2 R46.1
NetQ12_2: Q12.2(CATHODE) R47.1
NetQ12_3: Q12.3(EMITTER) Q14.1(G) R44.2 R48.1

### Library data of the parts
Q11 Q12 = FOD817BS: as Q1 on sheet Flash_Driver; SnapEDA_Link: https://www.snapeda.com/parts/FOD817BS/Onsemi/view-part/?ref=snap; Package: SMD-4 ON Semiconductor; Value: *; MP: FOD817BS; Check_prices: https://www.snapeda.com/parts/FOD817BS/Onsemi/view-part/?ref=eda
R43-R48 = 10k 850

## Nets that join several sheets
5V_external: Power (J1.1 PS3.5 PS3.6), Battey_Voltage (U1.1), ekstralar (J6.2 J7.2 J9.01 J12.2), Motor_ESC (Q11.4 Q12.4 Q13.2 Q14.2)
+5: Power (5 pins), Battey_Voltage (R1.1 R11.2), BNO055 (R21.1 R26.1), ekstralar (J10.01 SEN1.5V SEN2.5V), Teensy4.1 (C20.2 TENSY1.VIN)
+12: Power (CN2.P), ekstralar (J13.01), Emergancy (K1.COM Q9.4 Q10.2)
+24: Power (5 pins), Battey_Voltage (R3.1), Flash_Driver (6 pins), ekstralar (J8.01)
GND: Power (10 pins), Battey_Voltage (5 pins), Flash_Driver (R12.2 R14.2 R16.2), BNO055 (13 pins), NEO-M9N (16 pins), ekstralar (8 pins), Teensy4.1 (13 pins), Emergancy (R39.2), Motor_ESC (R45.2 R47.2)
GND1: Power (8 pins), Battey_Voltage (R5.2 R6.2 R7.1 U1.4), Flash_Driver (6 pins), ekstralar (5 pins), Motor_ESC (R46.2 R48.2)
GND2: Power (CN2.N), ekstralar (J13.02), Emergancy (J15.02 K1.C1 R40.2)
XTAL_IN: Power (5 pins), Battey_Voltage (R2.1 R10.2 U1.8), BNO055 (11 pins), NEO-M9N (6 pins), ekstralar (9 pins), Teensy4.1 (9 pins)
BACKUP: NEO-M9N (BAT1.P C18.1 R35.2 U4.22), Teensy4.1 (TENSY1.VBAT)
BAT_SEN_SCL: Battey_Voltage (R8.2 U2.5), Teensy4.1 (R52.1 U5.2)
BAT_SEN_SDA: Battey_Voltage (R9.2 U2.4), Teensy4.1 (R56.2 U5.3)
BCLDCMCU1: Teensy4.1 (TENSY1.D10), Motor_ESC (Q11.1)
BCLDCMCU2: Teensy4.1 (TENSY1.D9), Motor_ESC (Q12.1)
BLDC1: ekstralar (J6.1), Motor_ESC (Q13.3 R43.1)
BLDC2: ekstralar (J7.1), Motor_ESC (Q14.3 R44.1)
BLDC3: ekstralar (J12.1), Teensy4.1 (TENSY1.D14)
BNO055SCL: BNO055 (Q7.3 R21.2 R23.2), ekstralar (R50.2), Teensy4.1 (R71.2 U11.3)
BNO055SDA: BNO055 (Q8.3 R26.2 R27.2), ekstralar (R49.2), Teensy4.1 (R68.1 U11.2)
Emergancy: Teensy4.1 (TENSY1.D6), Emergancy (Q9.1)
Flash1: Flash_Driver (Q1.1), Teensy4.1 (TENSY1.D5)
Flash2: Flash_Driver (Q2.1), Teensy4.1 (TENSY1.D4)
Flash3: Flash_Driver (Q3.1), Teensy4.1 (TENSY1.D3)
GPS_RX_BUF: NEO-M9N (R33.1), Teensy4.1 (R58.2 U6.4)
GPS_TX: NEO-M9N (R32.1), Teensy4.1 (R61.2 U8.3)
GPSRXMODBUF: ekstralar (SEN1.RX), Teensy4.1 (R51.2 U6.6)
GPSTXMOD: ekstralar (SEN1.TX), Teensy4.1 (R66.2 U9.1)
JETSON_RX_BUF: ekstralar (J14.1), Teensy4.1 (R59.1 U7.4)
JETSON_TX: ekstralar (J14.2), Teensy4.1 (R72.2 U10.1)
LoRa_1_AUX: ekstralar (CN3.4), Teensy4.1 (TENSY1.D38)
LoRa_1_M0: ekstralar (CN3.0 R37.2), Teensy4.1 (TENSY1.D33)
LoRa_1_M1: ekstralar (CN3.1 R38.2), Teensy4.1 (TENSY1.D37)
LoRa_2_AUX: ekstralar (CN4.4), Teensy4.1 (TENSY1.D36)
LoRa_2_M0: ekstralar (CN4.0 R41.2), Teensy4.1 (TENSY1.D32)
LoRa_2_M1: ekstralar (CN4.1 R42.2), Teensy4.1 (TENSY1.D31)
LoRa_RX1_BUF: ekstralar (CN3.2), Teensy4.1 (R60.1 U7.6)
LoRa_RX2: ekstralar (CN4.2), Teensy4.1 (R54.2)
LoRa_TX1: ekstralar (CN3.3), Teensy4.1 (R67.2 U10.3)
LoRa_TX2: ekstralar (CN4.3), Teensy4.1 (R63.2)
XBEERX: ekstralar (XBEE1.DIN), Teensy4.1 (R57.2)
XBEETX: ekstralar (XBEE1.DOUT), Teensy4.1 (R64.2)